# EAGLE schematic rpiShield (EAGLE 6.1)
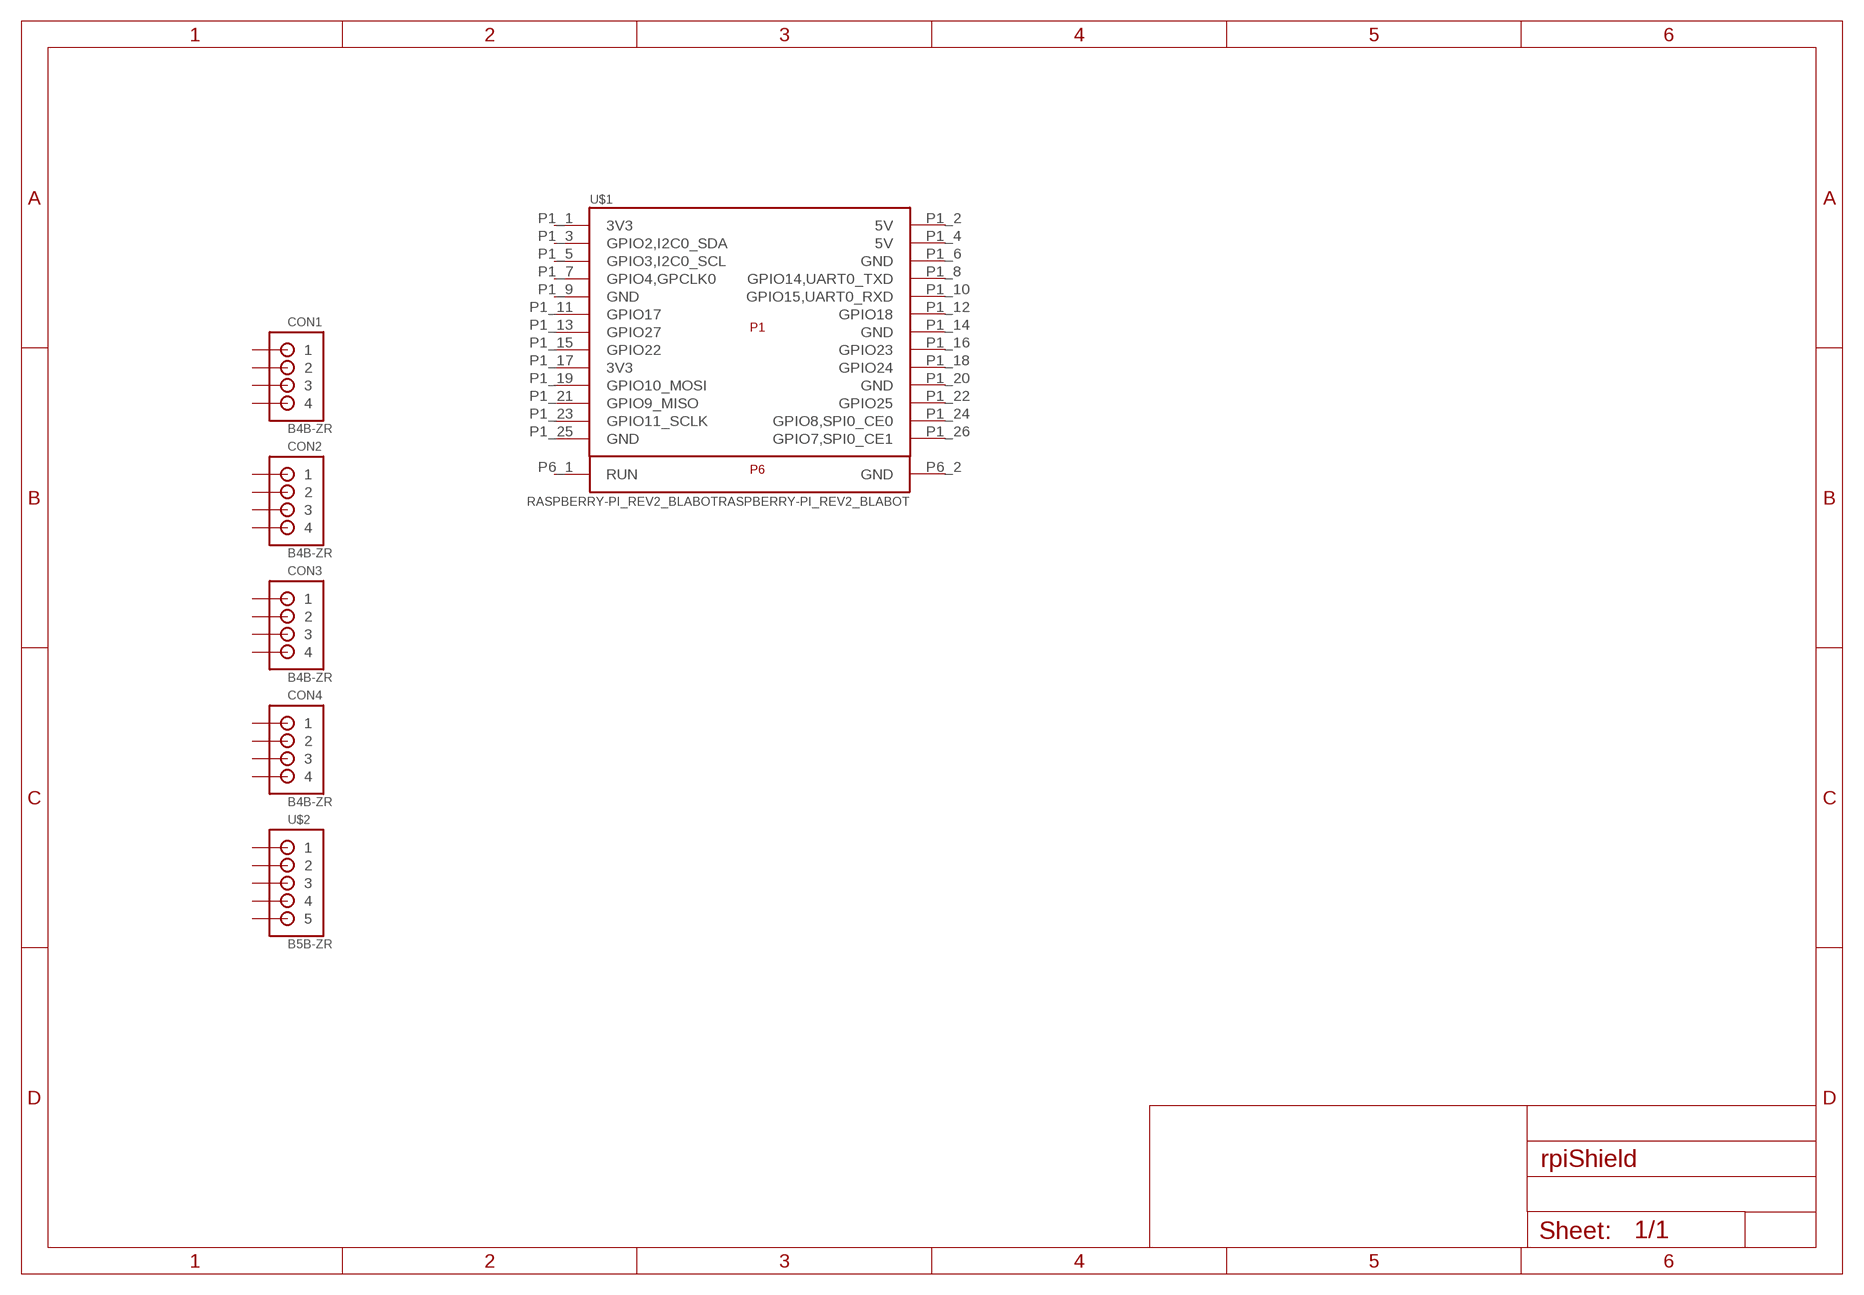
[diagram p0: schematic, sheet 1]

## Parts
CON1  B4B-ZR  [B4B-ZR]
CON2  B4B-ZR  [B4B-ZR]
CON3  B4B-ZR  [B4B-ZR]
CON4  B4B-ZR  [B4B-ZR]
U$1  RASPBERRY-PI_REV2_BLABOTRASPBERRY-PI_REV2_BLABOT  [RASPBERRY-PI_REV2_BLABOT]
U$2  B5B-ZR  [B5B-ZR]
Unconnected: CON1.1 CON1.2 CON1.3 CON1.4 CON2.1 CON2.2 CON2.3 CON2.4 CON3.1 CON3.2 CON3.3 CON3.4 CON4.1 CON4.2 CON4.3 CON4.4 U$1.P1_1(3V3) U$1.P1_2(5V) U$1.P1_3(GPIO2,I2C0_SDA) U$1.P1_4(5V) U$1.P1_5(GPIO3,I2C0_SCL) U$1.P1_6(GND) U$1.P1_7(GPIO4,GPCLK0) U$1.P1_8(GPIO14,UART0_TXD) U$1.P1_9(GND) U$1.P1_10(GPIO15,UART0_RXD) U$1.P1_11(GPIO17) U$1.P1_12(GPIO18) U$1.P1_13(GPIO27) U$1.P1_14(GND) U$1.P1_15(GPIO22) U$1.P1_16(GPIO23) U$1.P1_17(3V3) U$1.P1_18(GPIO24) U$1.P1_19(GPIO10_MOSI) U$1.P1_20(GND) U$1.P1_21(GPIO9_MISO) U$1.P1_22(GPIO25) U$1.P1_23(GPIO11_SCLK) U$1.P1_24(GPIO8,SPI0_CE0) U$1.P1_25(GND) U$1.P1_26(GPIO7,SPI0_CE1) U$1.P6_1(RUN) U$1.P6_2(GND) U$2.1 U$2.2 U$2.3 U$2.4 U$2.5

## Library data of the parts
CON1-CON4 = jst:B4B-ZR: JST-ZH Connector 4 pol, 1.5mm pitch Package: B4B-ZR Source: http://www.jst-mfg.com/product/pdf/eng/eZH.pdf
U$1 = RaspberryPi2:RASPBERRY-PI_REV2_BLABOT
U$2 = jst:B5B-ZR: JST-ZH Connector 5 pol, 1.5mm pitch Package: B5B-ZR Source: http://www.jst-mfg.com/product/pdf/eng/eZH.pdf